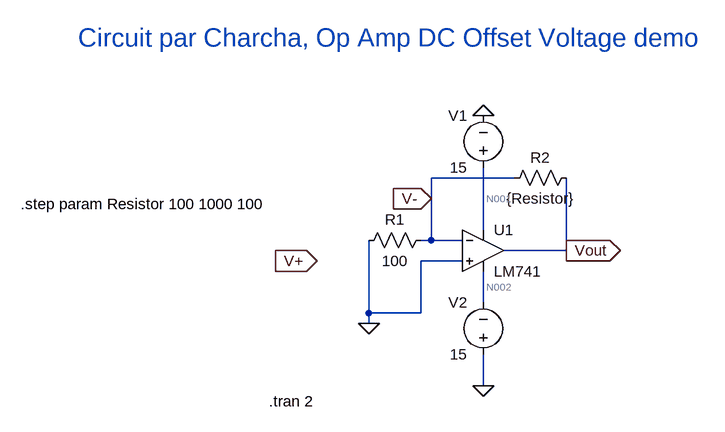
[diagram p0: schematic OpAmpDCOffsetDemo.asc]
OpAmpDCOffsetDemo.asc, the LTspice schematic file:
Version 4
SHEET 1 880 680
WIRE 192 32 64 32
WIRE 64 64 64 32
WIRE 144 112 144 16
WIRE 64 128 64 64
WIRE 64 128 48 128
WIRE 112 128 64 128
WIRE 272 144 272 32
WIRE 272 144 176 144
WIRE 112 160 48 160
WIRE 144 224 144 176
WIRE -32 240 -32 128
WIRE 48 240 48 160
WIRE 48 240 -32 240
WIRE -32 256 -32 240
WIRE 144 352 144 304
FLAG 144 -64 0
FLAG 144 352 0
FLAG -112 160 V+
IOPIN -112 160 In
FLAG 64 64 V-
IOPIN 64 64 In
FLAG 272 144 Vout
IOPIN 272 144 Out
FLAG -32 256 0
SYMBOL OpAmps\\LM741 144 80 R0
SYMATTR InstName U1
SYMBOL voltage 144 32 R180
WINDOW 0 24 96 Left 2
WINDOW 3 24 16 Left 2
WINDOW 123 0 0 Left 0
WINDOW 39 0 0 Left 0
SYMATTR InstName V1
SYMATTR Value 15
SYMBOL voltage 144 320 R180
WINDOW 0 24 96 Left 2
WINDOW 3 24 16 Left 2
WINDOW 123 0 0 Left 0
WINDOW 39 0 0 Left 0
SYMATTR InstName V2
SYMATTR Value 15
SYMBOL res 64 112 R90
WINDOW 0 0 56 VBottom 2
WINDOW 3 32 56 VTop 2
SYMATTR InstName R1
SYMATTR Value 100
SYMBOL res 288 16 R90
WINDOW 0 0 56 VBottom 2
WINDOW 3 32 56 VTop 2
SYMATTR InstName R2
SYMATTR Value {Resistor}
TEXT -186 376 Left 2 !.tran 2
TEXT -568 72 Left 2 !.step param Resistor 100 1000 100
TEXT -480 -184 Left 4 ;Circuit par Charcha, Op Amp DC Offset Voltage demo

The netlist it stands for:
* OpAmpDCOffsetDemo.asc
XU1 0 V- N001 N002 Vout LM741  ; pins In+ In- V+ V- OUT
V1 N001 0 15
V2 0 N002 15
R1 V- 0 100
R2 Vout V- {Resistor}
.tran 2
.step param Resistor 100 1000 100
* Circuit par Charcha, Op Amp DC Offset Voltage demo
.lib LM741.lib
.backanno
.end

* Results of the author's LTspice run, read from the files saved beside the schematic
* Operating Point (first step), zero values left out:
*   resistor = 100 
*   V(v-) = 1 mV
*   V(n002) = -15 V
*   V(n001) = 15 V
*   V(vout) = 2.01 mV
*   I(R2) = 10.1 µA
*   I(R1) = 10 µA
*   I(V2) = -1.696 mA
*   I(V1) = -1.706 mA
*   Ix(u1:1) = 57.86 nA
*   Ix(u1:2) = 101.9 nA
*   Ix(u1:99) = 1.706 mA
*   Ix(u1:50) = -1.696 mA
*   Ix(u1:28) = -10.1 µA
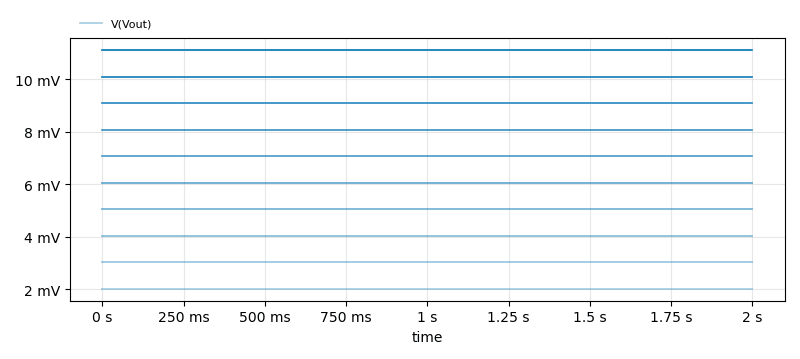
[diagram p1: Transient Analysis of OpAmpDCOffsetDemo.asc, plotted from the saved traces]
* Transient Analysis, 10 runs:
*   V(Vout) [resistor=100]: min 2.01 mV, max 2.01 mV, average 2.01 mV, rms 2.01 mV, last 2.01 mV
*   V(Vout) [resistor=200]: min 3.02 mV, max 3.02 mV, average 3.02 mV, rms 3.02 mV, last 3.02 mV
*   V(Vout) [resistor=300]: min 4.031 mV, max 4.031 mV, average 4.031 mV, rms 4.031 mV, last 4.031 mV
*   V(Vout) [resistor=400]: min 5.041 mV, max 5.041 mV, average 5.041 mV, rms 5.041 mV, last 5.041 mV
*   V(Vout) [resistor=500]: min 6.051 mV, max 6.051 mV, average 6.051 mV, rms 6.051 mV, last 6.051 mV
*   V(Vout) [resistor=600]: min 7.061 mV, max 7.061 mV, average 7.061 mV, rms 7.061 mV, last 7.061 mV
*   V(Vout) [resistor=700]: min 8.071 mV, max 8.071 mV, average 8.071 mV, rms 8.071 mV, last 8.071 mV
*   V(Vout) [resistor=800]: min 9.081 mV, max 9.081 mV, average 9.081 mV, rms 9.081 mV, last 9.081 mV